# Altium project HW1.PrjPcb
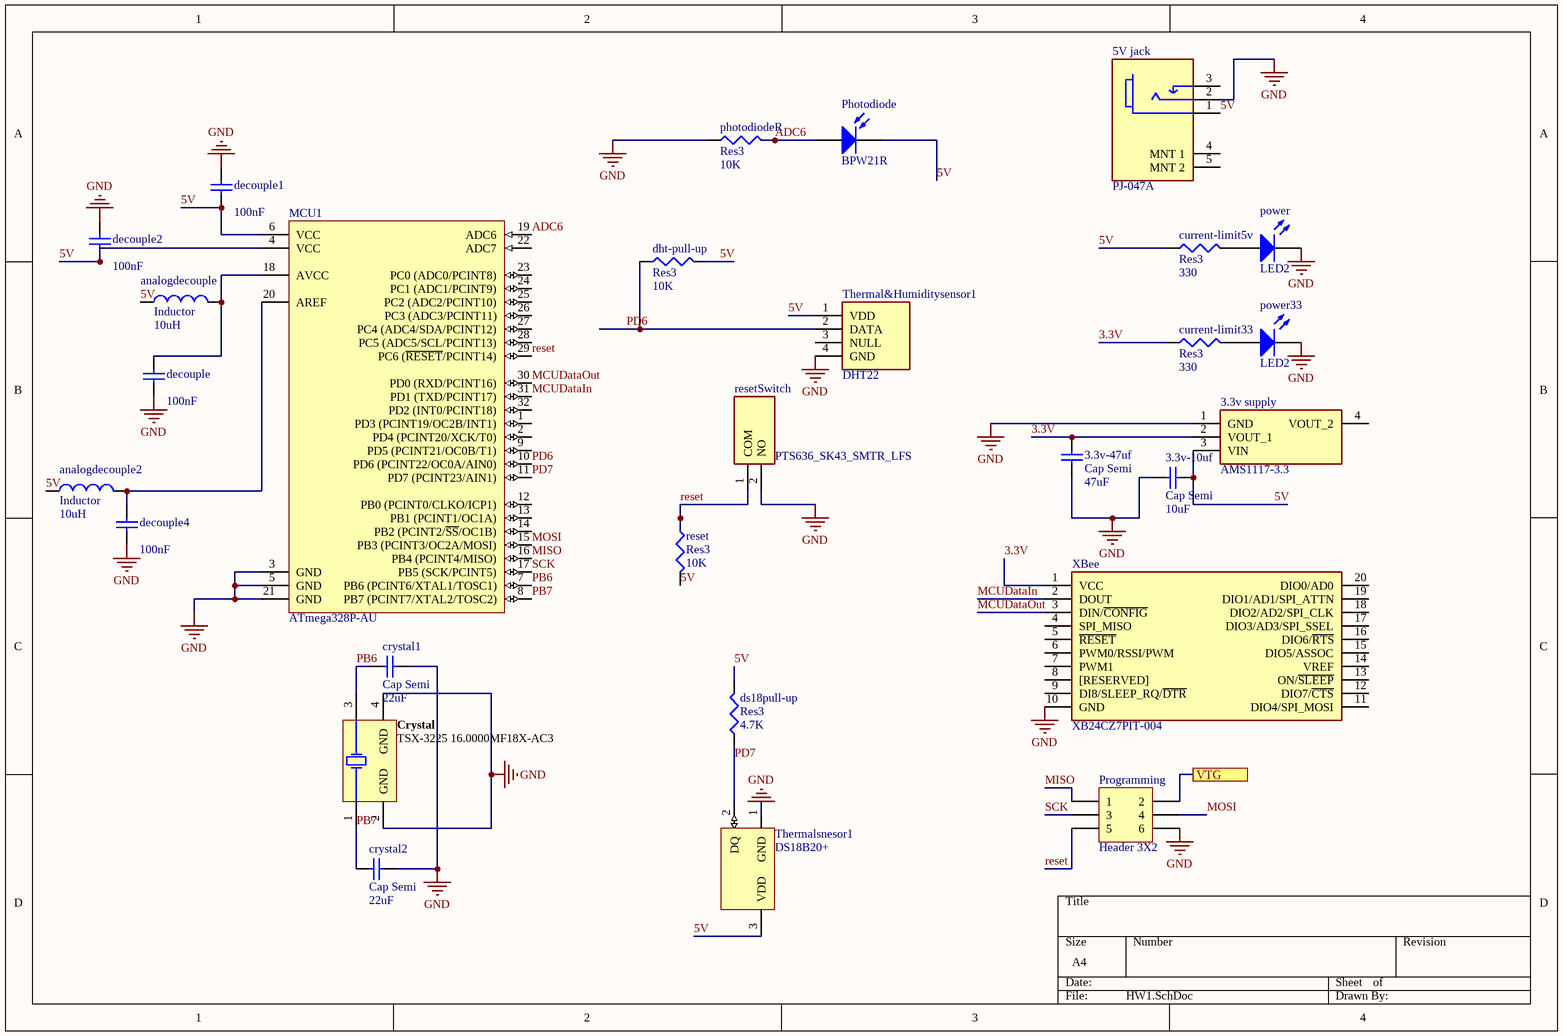
[diagram p0: HW1.SchDoc]
1 sheet, 28 parts. Net scope: flat (ports and power ports of the same name join across sheets).
Board file: HW1PCB1.PcbDoc

## Sheet HW1.SchDoc
size A4

### Parts
3.3v-10uf  Cap Semi  value 10uF  [C1206]
3.3v-47uf  Cap Semi  value 47uF  [C1206]
3.3v_supply  AMS1117-3.3  [SOT229P700X180-4N]
5V_jack  PJ-047A  [FP-PJ-047A-MFG]
analogdecouple  Inductor  value 10uH  [INDC1608L]
analogdecouple2  Inductor  value 10uH  [INDC1608L]
Crystal  TSX-3225 16.0000MF18X-AC3  [EPSON-TSX-3225_V]
crystal1  Cap Semi  value 22uF  [C1206]
crystal2  Cap Semi  value 22uF  [C1206]
current-limit5v  Res3  value 330  [J1-0603]
current-limit33  Res3  value 330  [J1-0603]
decouple  value 100nF  [C1206]
decouple1  value 100nF  [C1206]
decouple2  value 100nF  [C1206]
decouple4  value 100nF  [C1206]
dht-pull-up  Res3  value 10K  [J1-0603]
ds18pull-up  Res3  value 4.7K  [J1-0603]
MCU1  ATmega328P-AU  [32A_N]
Photodiode  BPW21R  [VISH-BPW21R-2]
photodiodeR  Res3  value 10K  [J1-0603]
power  LED2  [3.2X1.6X1.1]
power33  LED2  [3.2X1.6X1.1]
Programming  Header 3X2  [HDR2X3]
reset  Res3  value 10K  [J1-0603]
resetSwitch  PTS636_SK43_SMTR_LFS  [PTS636SK43SMTRLFS]
Thermal&Humiditysensor1  DHT22  [DHT22]
Thermalsnesor1  DS18B20+  [Q3+1]
XBee  XB24CZ7PIT-004  [XB24CAPIT-001]

### Ports
VTG

### Nets
GND: 3.3v-10uf.1 3.3v-47uf.1 3.3v_supply.1(GND) 5V_jack.2 Crystal.2(GND) Crystal.4(GND) crystal1.2 crystal2.2 decouple.1 decouple1.2 decouple2.2 decouple4.1 MCU1.3(GND) MCU1.5(GND) MCU1.21(GND) photodiodeR.1 power.2(K) power33.2(K) Programming.6 resetSwitch.2(NO) Thermal&Humiditysensor1.4(GND) Thermalsnesor1.1(GND) XBee.10(GND)
3.3V: 3.3v-47uf.2 3.3v_supply.2(VOUT_1) current-limit33.1 XBee.1(VCC)
5V: 3.3v-10uf.2 3.3v_supply.3(VIN) 5V_jack.1 analogdecouple.1 analogdecouple2.1 current-limit5v.1 decouple1.1 decouple2.1 dht-pull-up.2 ds18pull-up.2 MCU1.4(VCC) MCU1.6(VCC) Photodiode.2(K) reset.2 Thermal&Humiditysensor1.1(VDD) Thermalsnesor1.3(VDD)
ADC6: MCU1.19(ADC6) Photodiode.1(A) photodiodeR.2
MCUDataIn: MCU1.31(PD1_(TXD/PCINT17)) XBee.2(DOUT)
MCUDataOut: MCU1.30(PD0_(RXD/PCINT16)) XBee.3(DIN/~{CONFIG})
MISO: MCU1.16(PB4_(PCINT4/MISO)) Programming.1
MOSI: MCU1.15(PB3_(PCINT3/OC2A/MOSI)) Programming.4
PB6: Crystal.3(X2) crystal1.1 MCU1.7(PB6_(PCINT6/XTAL1/TOSC1))
PB7: Crystal.1(X1) crystal2.1 MCU1.8(PB7_(PCINT7/XTAL2/TOSC2))
PD6: dht-pull-up.1 MCU1.10(PD6_(PCINT22/OC0A/AIN0)) Thermal&Humiditysensor1.2(DATA)
PD7: ds18pull-up.1 MCU1.11(PD7_(PCINT23/AIN1)) Thermalsnesor1.2(DQ)
reset: MCU1.29(PC6_(~{RESET}/PCINT14)) Programming.5 reset.1 resetSwitch.1(COM)
SCK: MCU1.17(PB5_(SCK/PCINT5)) Programming.3
Netanalogdecouple2_2: analogdecouple2.2 decouple4.2 MCU1.20(AREF)
Netanalogdecouple_2: analogdecouple.2 decouple.2 MCU1.18(AVCC)
Netcurrent-limit5v_2: current-limit5v.2 power.1(A)
Netcurrent-limit33_2: current-limit33.2 power33.1(A)
NetProgramming_2: Programming.2 ; port VTG

Not connected (* = marked no-connect by the designer): 3.3v_supply 4(VOUT_2); 5V_jack 3 4(MNT_1) 5(MNT_2); MCU1 1(PD3_(PCINT19/OC2B/INT1)) 2(PD4_(PCINT20/XCK/T0)) 9(PD5_(PCINT21/OC0B/T1)) 12(PB0_(PCINT0/CLKO/ICP1)) 13(PB1_(PCINT1/OC1A)) 14(PB2_(PCINT2/~{SS}/OC1B)) 22(ADC7) 23(PC0_(ADC0/PCINT8)) 24(PC1_(ADC1/PCINT9)) 25(PC2_(ADC2/PCINT10)) 26(PC3_(ADC3/PCINT11)) 27(PC4_(ADC4/SDA/PCINT12)) 28(PC5_(ADC5/SCL/PCINT13)) 32(PD2_(INT0/PCINT18)); Thermal&Humiditysensor1 3(NULL); XBee 4(SPI_MISO) 5(~{RESET}) 6(PWM0/RSSI/PWM) 7(PWM1) 8([RESERVED]) 9(DI8/SLEEP_RQ/~{DTR}) 11(DIO4/SPI_MOSI) 12(DIO7/~{CTS}) 13(ON/~{SLEEP}) 14(VREF) 15(DIO5/ASSOC) 16(DIO6/~{RTS}) 17(DIO3/AD3/SPI_SSEL) 18(DIO2/AD2/SPI_CLK) 19(DIO1/AD1/SPI_ATTN) 20(DIO0/AD0)

### Library data of the parts
3.3v-10uf 3.3v-47uf crystal1 crystal2 decouple decouple1 decouple2 decouple4 = Cap Semi: Capacitor (Semiconductor SIM Model); Published: 8-Jun-2000; LatestRevisionDate: 29-May-2009; LatestRevisionNote: IPC-7351 Footprint Added.; PackageReference: C1206; Publisher: Altium Limited; PackageDescription: Chip Capacitor
3.3v_supply = AMS1117-3.3: Integrated Circuit; Manufacturer_Name: Advanced Monolithic Systems; Datasheet Link: http://www.advanced-monolithic.com/pdf/ds1117.pdf; Height: 1.8mm; Manufacturer_Part_Number: AMS1117-3.3
5V_jack = CMP-14830-000005-1: CONN PWR JACK 2X5.5MM SOLDER; Manufacturer: CUI Inc; Conn Orientation: Right Angle; Shielding: true; Current Rating: 2.5A; Conn Gender: Male; Number Of Contacts: 3; Voltage Rating: 24V; Temperature Range High: +85°C; Manufacturer Part Number: PJ-047A; RoHS: TRUE; Height: 9.7mm; Octopart: https://octopart.com/pj-047a-cui-19052783; Digikey Description: CONN PWR JACK 2X5.5MM SOLDER; ComponentLink2URL: https://www.cui.com/product/resource/pj-047a.pdf; Lead Free: Yes; Device Class L1: Connectors; Contact Material: Tin,Nickel; Temperature: -25°C to +85°C; Temperature Range Low: -25°C; Automotive: No; Device Class L2: Power Connectors; Mouser Description: 2.0 x 6.0 mm, 2.5 A, Horizontal, Through Hole, Shielded, Dc Power Jack Connector; Package: PJ-047A; Category: Conn; ComponentLink2Description: Datasheet; Device Class L3: unset
analogdecouple analogdecouple2 = Inductor: Code_IEC: 1005; Published: 8-Jun-2000; LatestRevisionDate: 29-May-2009; LatestRevisionNote: IPC-7351 Footprint Added.; PackageReference: 0402-A; Publisher: Altium Limited; PackageDescription: Chip Inductor; Code_JEITA: 0402
Crystal = CMP-2000-07332-1: MHz Range Crystal Unit, 16 MHz, -40 to 85 degC, 4-Pin SMD, RoHS, Tape and Reel; Manufacturer: Epson; Unit Weight: 0.000564oz; Tolerance: 10PPM; ESR: 60Ohms; Frequency: 16MHz; Drive Level: 200uW; Brand: EpsonTiming; Load Capacitance: 9pF; Product Category: Crystals; Packaging: Reel; Termination Style: SMD/SMT; Width: 2.5mm; Length: 3.2mm; Type: Crystal; Datasheet Version: 12/2015; Factory Pack Quantity: 250; Package Description: 4-Pin Surface Mount Device, Body 3.2 x 2.5 mm; Package / Case: 3.2mmx2.5mm; Mounting Style: SMD/SMT; Series: TSX-3225; Frequency Stability: 10PPM; Package Reference: TSX-3225; Mounting Technology: SurfaceMount; RoHS: True; Height: 0.6mm; Datasheet URL: https://support.epson.biz/td/api/doc_check.php?dl=brief_FA-238V_en.pdf; Operating Temperature Range: -40Cto+85C; Manufacturer URL: https://www.eea.epson.com/
current-limit5v current-limit33 dht-pull-up ds18pull-up photodiodeR reset = Res3: Resistor; Published: 8-Jun-2000; LatestRevisionDate: 29-May-2009; LatestRevisionNote: IPC-7351 Footprint Added.; PackageReference: J1-0603; Publisher: Altium Limited; PackageDescription: Chip Resistor
MCU1 = CMP-0095-00269-2: 8-bit AVR Microcontroller, 32KB Flash, 1KB EEPROM, 2KB SRAM, 32-pin TQFP, Industrial Grade (-40°C to 85°C); PackageDescription: 32-Lead, 7x7x1.0 mm Body, 0.8mm Lead Pitch, Thin Profile Plastic Quad Flat Package (TQFP); DatasheetVersion: revD, May-2011; RevisionNote: DatasheetVersion & PackageVersion updated. URLs added.; ComponentLink1URL: http://www.atmel.com/; ComponentLink2Description: ATmega48A/48PA/88A/88PA/168A/168PA/328/328P Datasheet; Code_JEDEC: MS-026-ABA; ComponentLink1Description: Manufacturer URL; PackageReference: 32A; ComponentLink3Description: ATmega48A/48PA/88A/88PA/168A/168PA/328/328P Summary; ComponentLink2URL: http://www.atmel.com/dyn/resources/prod_documents/doc8271.pdf; PackageVersion: revC, Oct-2010; ComponentLink3URL: http://www.atmel.com/dyn/resources/prod_documents/8271S.pdf
Photodiode = CMP-2000-05428-1: Silicon Photodiode, 565 nm, -40 to 125 degC, 2-Pin TO-5, RoHS, Bulk; Manufacturer: Vishay; Wavelength of Peak Sensitivity: 565nm; Dark Current: 2000pA; SVHC: ToBeAdvised; Angle of Half Sensitivity ±: 50deg; No. of Pins: 2Pins; Product Range: -; Manufacturer URL: http://www.vishay.com/; Operating Temperature Max: 125degC; Datasheet URL: https://datasheet.ciiva.com/25620/0900766b80e22c15-25620368.pdf; Diode Case Style: TO-5; Operating Temperature Min: -40degC; Automotive Qualification Standard: -; MSL: -; Packaging: Each; Datasheet Version: Rev. 1.7, 11/2011
power power33 = LED2: Typical RED, GREEN, YELLOW, AMBER GaAs LED; Published: 8-Jun-2000; LatestRevisionDate: 17-Jul-2002; LatestRevisionNote: Re-released for DXP Platform.; PackageVersion: Feb-2002; PackageReference: 3.2X1.6X1.1; Publisher: Altium Limited; PackageDescription: SM LED; 2 Flat Leads
Programming = Header 3X2: Header, 3-Pin, Dual row; LatestRevisionDate: 17-Jul-2002; LatestRevisionNote: Re-released for DXP Platform.; Publisher: Altium Limited
resetSwitch = PTS636_SK43_SMTR_LFS: Switch; Manufacturer_Name: C & K COMPONENTS; Manufacturer_Part_Number: PTS636 SK43 SMTR LFS; Datasheet Link: https://componentsearchengine.com/Datasheets/1/PTS636 SK43 SMTR LFS.pdf; Height: 4.5mm; Arrow Part Number: PTS636 SK43 SMTR LFS; Arrow Price/Stock: https://www.arrow.com/en/products/pts636-sk43-smtr-lfs/ck; Mouser Part Number: 611-PTS636SK43SMTRLF; Mouser Price/Stock: https://www.mouser.co.uk/ProductDetail/CK/PTS636-SK43-SMTR-LFS?qs=vLWxofP3U2wsQpQ593zsYw%3D%3D
Thermal&Humiditysensor1 = DHT22: Integrated Circuit; Manufacturer_Name: Aosong Electronics; Datasheet Link: https://datasheet4u.com/datasheet-parts/DHT22-datasheet.php?id=792211; Height: 25.1mm; Manufacturer_Part_Number: DHT22
Thermalsnesor1 = CMP-0253-00003-1: Programmable Resolution Digital Thermometer, 1-Wire Interface, ±0.5°C Accuracy, 3-Pin TO92, -55°C to +125°C, Pb-Free; ComponentLink2URL: http://datasheets.maxim-ic.com/en/ds/DS18B20.pdf; PackageReference: Q3+1; ComponentLink1Description: Manufacturer URL; PackageDescription: TO-92 Package, Body Dia. 4.7mm; Leads 0.51 x 0.51 mm (max), Pb-Free; DatasheetVersion: 2007; Code_JEDEC: TO-226-AA; ComponentLink1URL: http://www.maxim-ic.com; PackageVersion: revB, 2009; ComponentLink2Description: Datasheet
XBee = XB24CZ7PIT-004: Integrated Circuit; Manufacturer_Name: Digi International; Datasheet Link: http://www.digi.com/pdf/ds_xbee_zigbee.pdf; Manufacturer_Part_Number: XB24CZ7PIT-004; Arrow Part Number: XB24CZ7PIT-004; Arrow Price/Stock: https://www.arrow.com/en/products/xb24cz7pit-004/digi-international; Mouser Part Number: 888-XB24CZ7PIT-004; Mouser Price/Stock: https://www.mouser.com/Search/Refine.aspx?Keyword=888-XB24CZ7PIT-004